# EAGLE design eagle8 (EAGLE 7.2.0)
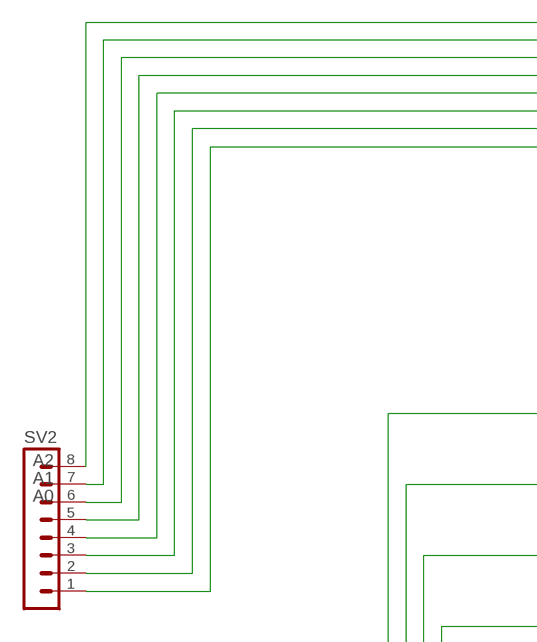
[diagram p0: schematic, sheet 1, part 1 of 3]
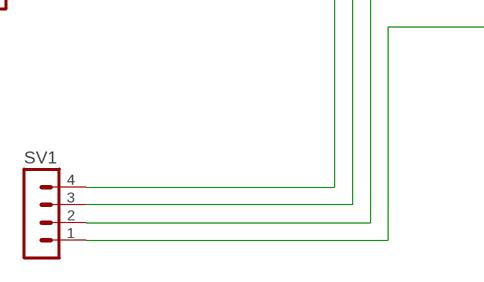
[diagram p1: schematic, sheet 1, part 2 of 3]
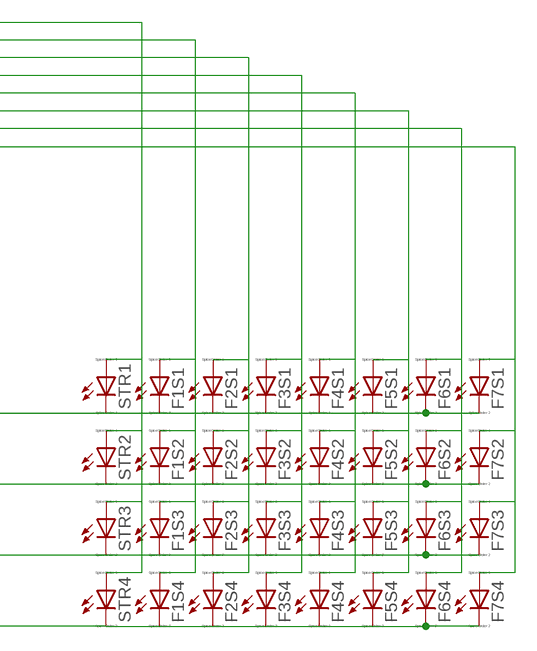
[diagram p2: schematic, sheet 1, part 3 of 3]

## Parts
F1S1  LED_ESML0603  [LED_SML0603]
F1S2  LED_ESML0603  [LED_SML0603]
F1S3  LED_ESML0603  [LED_SML0603]
F1S4  LED_ESML0603  [LED_SML0603]
F2S1  LED_ESML0603  [LED_SML0603]
F2S2  LED_ESML0603  [LED_SML0603]
F2S3  LED_ESML0603  [LED_SML0603]
F2S4  LED_ESML0603  [LED_SML0603]
F3S1  LED_ESML0603  [LED_SML0603]
F3S2  LED_ESML0603  [LED_SML0603]
F3S3  LED_ESML0603  [LED_SML0603]
F3S4  LED_ESML0603  [LED_SML0603]
F4S1  LED_ESML0603  [LED_SML0603]
F4S2  LED_ESML0603  [LED_SML0603]
F4S3  LED_ESML0603  [LED_SML0603]
F4S4  LED_ESML0603  [LED_SML0603]
F5S1  LED_ESML0603  [LED_SML0603]
F5S2  LED_ESML0603  [LED_SML0603]
F5S3  LED_ESML0603  [LED_SML0603]
F5S4  LED_ESML0603  [LED_SML0603]
F6S1  LED_ESML0603  [LED_SML0603]
F6S2  LED_ESML0603  [LED_SML0603]
F6S3  LED_ESML0603  [LED_SML0603]
F6S4  LED_ESML0603  [LED_SML0603]
F7S1  LED_ESML0603  [LED_SML0603]
F7S2  LED_ESML0603  [LED_SML0603]
F7S3  LED_ESML0603  [LED_SML0603]
F7S4  LED_ESML0603  [LED_SML0603]
STR1  LED_ESML0603  [LED_SML0603]
STR2  LED_ESML0603  [LED_SML0603]
STR3  LED_ESML0603  [LED_SML0603]
STR4  LED_ESML0603  [LED_SML0603]
SV1  MA04-1  [MA04-1]
SV2  MA08-1  [MA08-1]

## Nets
A0: F2S1.A F2S2.A F2S3.A F2S4.A SV2.6
A1: F1S1.A F1S2.A F1S3.A F1S4.A SV2.7
A2: STR1.A STR2.A STR3.A STR4.A SV2.8
N$2: F1S3.C F2S3.C F3S3.C F4S3.C F5S3.C F6S3.C F7S3.C STR3.C SV1.2
N$3: F1S2.C F2S2.C F3S2.C F4S2.C F5S2.C F6S2.C F7S2.C STR2.C SV1.3
N$8: F1S1.C F2S1.C F3S1.C F4S1.C F5S1.C F6S1.C F7S1.C STR1.C SV1.4
N$10: F7S1.A F7S2.A F7S3.A F7S4.A SV2.1
N$23: F6S1.A F6S2.A F6S3.A F6S4.A SV2.2
N$25: F4S1.A F4S2.A F4S3.A F4S4.A SV2.4
N$26: F3S1.A F3S2.A F3S3.A F3S4.A SV2.5
N$28: F1S4.C F2S4.C F3S4.C F4S4.C F5S4.C F6S4.C F7S4.C STR4.C SV1.1
N$35: F5S1.A F5S2.A F5S3.A F5S4.A SV2.3

## Library data of the parts
F1S1-F1S4 F2S1-F2S4 F3S1-F3S4 F4S1-F4S4 F5S1-F5S4 F6S1-F6S4 F7S1-F7S4 STR1-STR4 = eagle-ltspice:LED_E: LED Source: http://www.osram.convergy.de Source: www.luxeon.com Source: www.kingbright.com; SPICEMODEL: NONE; SPICEPREFIX: D; SPICETYPE: diode
SV1 = con-lstb:MA04-1: PIN HEADER; OC_FARNELL: unknown; OC_NEWARK: unknown
SV2 = con-lstb:MA08-1: PIN HEADER; OC_FARNELL: unknown; OC_NEWARK: unknown

## Board
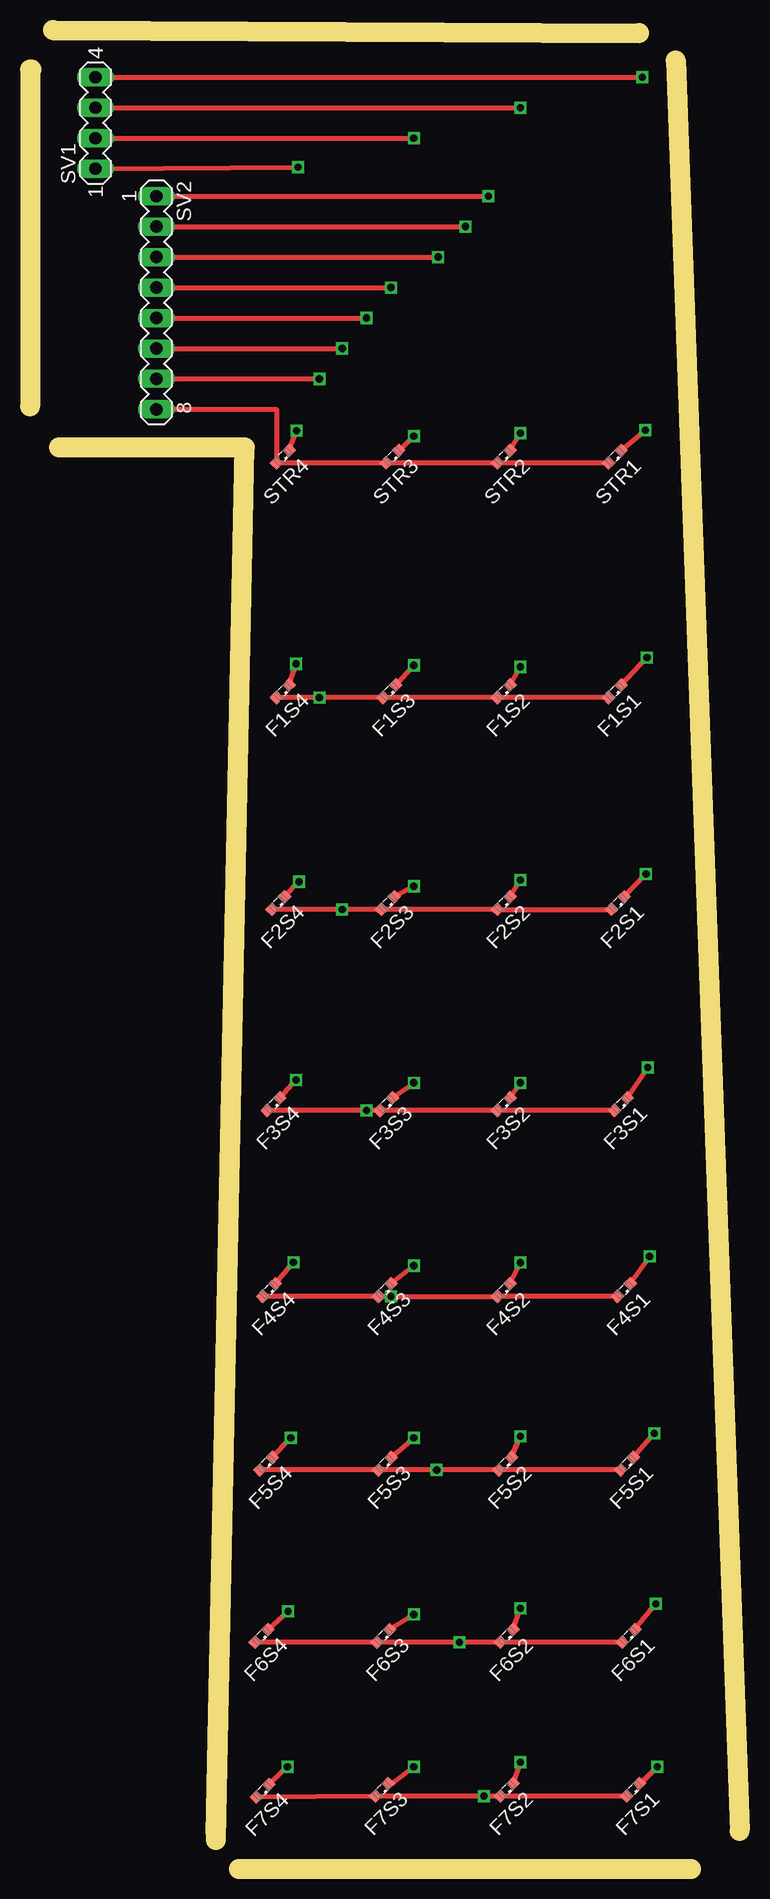
[diagram p3: board, top side]
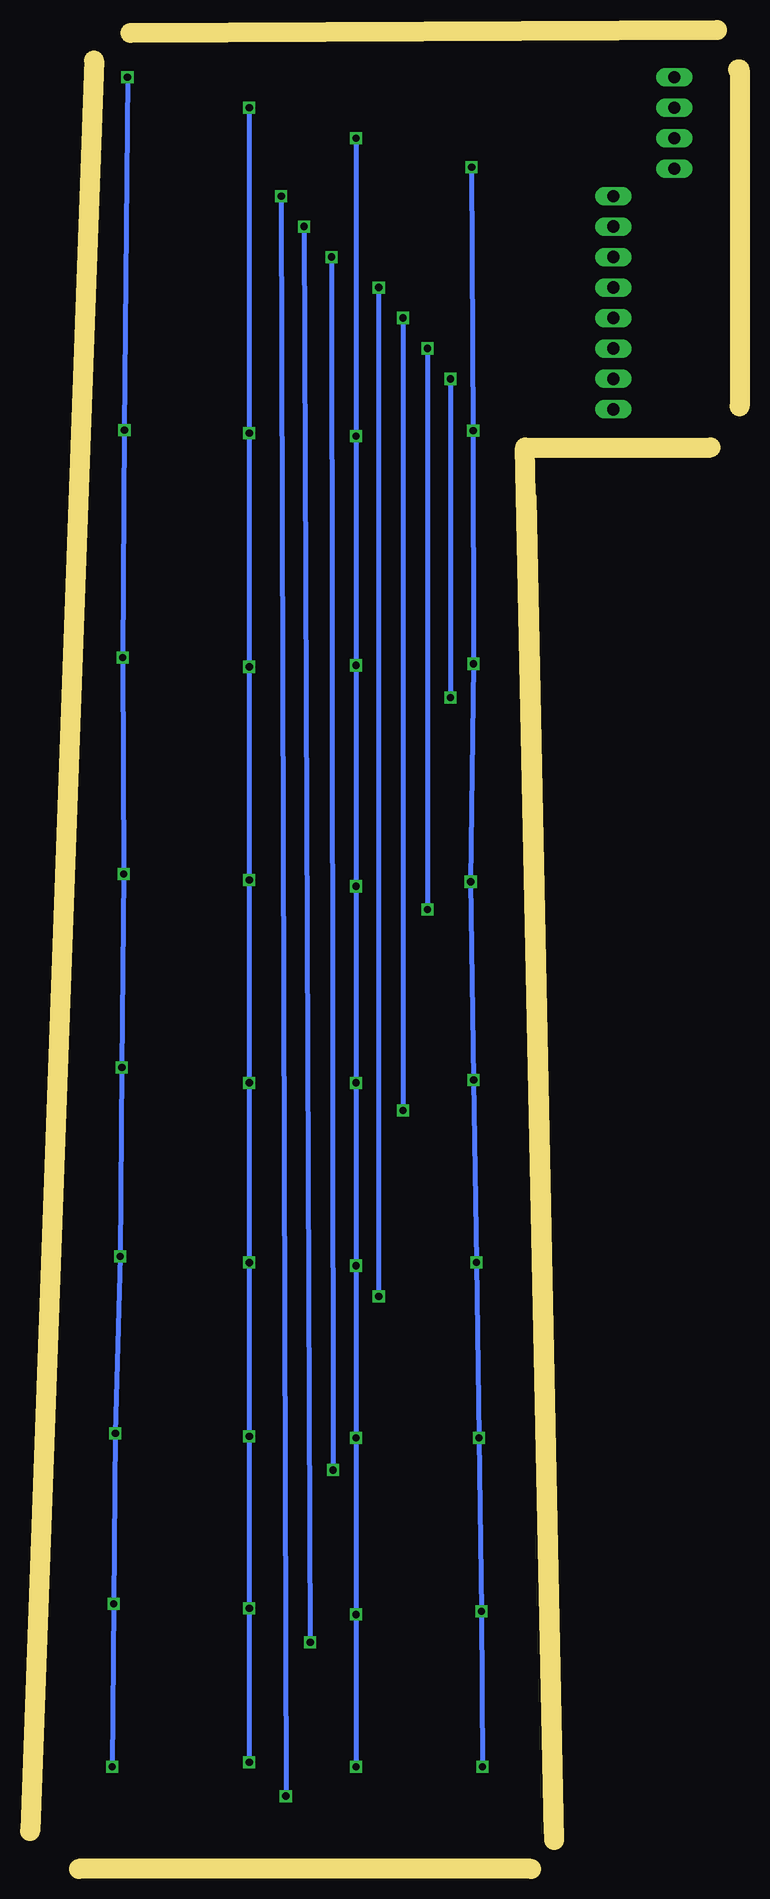
[diagram p4: board, bottom side, seen from below]

Size 59.18 x 153.29 mm. Coordinates in mm from the lower left corner, seen from the top.
Outline: 1.9,153.29 50.8,153.03
Outline: 53.85,150.75 59.18,3.17
Outline: 15.49,2.92 17.91,118.49 2.41,118.49
Outline: 0.13,149.99 0,149.99 0,121.92
Outline: 17.78,114.3 15.49,2.41
Outline: 17.4,0 55.12,0
Copper layers (1*16): Top 0.035mm / dielectric 1.5mm / Bottom 0.035mm
Design rules "default": minimum track width 10mil, minimum drill 24mil, track to track 8mil, track to pad 8mil, pad to pad 8mil, via to via 8mil, smd to smd 8mil, copper to edge 40mil, drill to drill 8mil, minimum pad ring 10mil, minimum via ring 8mil, stop-mask expansion 4mil, vias tented up to drill 0mil, thermal gap 10mil

### Footprints (pad centres in the part's own frame; a part is rotated, then mirrored left to right if it is on the bottom)
LED_SML0603 = smd 0.8 x 0.8: A 0.75,0; C -0.75,0
MA04-1 = drill 1.016 long: 1 -3.81,0; 2 -1.27,0; 3 1.27,0; 4 3.81,0
MA08-1 = drill 1.016 long: 1 -8.89,0; 2 -6.35,0; 3 -3.81,0; 4 -1.27,0; 5 1.27,0; 6 3.81,0; 7 6.35,0; 8 8.89,0

### Placement (x,y rotation side)
F1S1  48.77,98.17 225 top
F1S2  39.5,98.17 225 top
F1S3  29.97,98.17 225 top
F1S4  21.08,98.17 225 top
F2S1  49.02,80.52 225 top
F2S2  39.5,80.52 225 top
F2S3  29.85,80.52 225 top
F2S4  20.7,80.52 225 top
F3S1  49.28,63.75 225 top
F3S2  39.5,63.75 225 top
F3S3  29.72,63.75 225 top
F3S4  20.32,63.75 225 top
F4S1  49.53,48.26 225 top
F4S2  39.5,48.26 225 top
F4S3  29.59,48.26 225 top
F4S4  19.94,48.26 225 top
F5S1  49.78,33.78 225 top
F5S2  39.62,33.78 225 top
F5S3  29.59,33.78 225 top
F5S4  19.68,33.78 225 top
F6S1  49.91,19.43 225 top
F6S2  39.75,19.43 225 top
F6S3  29.46,19.43 225 top
F6S4  19.3,19.43 225 top
F7S1  50.29,6.6 225 top
F7S2  39.75,6.6 225 top
F7S3  29.34,6.6 225 top
F7S4  19.39,6.51 225 top
STR1  48.77,117.73 225 top
STR2  39.5,117.73 225 top
STR3  30.23,117.73 225 top
STR4  21.08,117.73 225 top
SV1  5.46,145.54 90 top
SV2  10.54,130.56 270 top

### Tracks (layer width: path | path; a pad name or v marks a point on that pad's centre or on a via)
A0  (via drill 0.6)
  Top 0.406: F2S1.A F2S2.A F2S3.A v26.04,79.99 F2S4.A | SV2.6 v26.04,126.75
  Bottom 0.406: v26.04,126.75 v26.04,79.99
A1  (via drill 0.6)
  Top 0.406: F1S1.A F1S2.A F1S3.A v24.13,97.64 F1S4.A | SV2.7 v24.13,124.21
  Bottom 0.406: v24.13,124.21 v24.13,97.64
A2
  Top 0.406: STR1.A STR2.A STR3.A STR4.A 20.55,121.67 SV2.8
N$2  (via drill 0.6)
  Top 0.406: STR3.C v32,119.42 | v32,8.51 30.25,7.13 F7S3.C | F6S3.C v32,21.21 | F5S3.C v32,35.94 | F4S3.C v32,50.29 | F3S3.C v32,65.53 | F2S3.C v32,81.92 | F1S3.C v32,100.33 | SV1.2 v32,144.27
  Bottom 0.406: v32,8.51 v32,21.21 v32,35.94 v32,50.29 v32,65.53 v32,81.92 v32,100.33 v32,119.42 v32,144.27
N$3  (via drill 0.6)
  Top 0.406: STR2.C v40.89,119.68 | v40.89,8.89 F7S2.C | F6S2.C v40.89,21.72 | F5S2.C v40.89,36.07 | F4S2.C v40.89,50.55 | F3S2.C v40.89,65.53 | F2S2.C v40.89,82.42 | F1S2.C v40.89,100.2 | SV1.3 v40.89,146.81
  Bottom 0.406: v40.89,8.89 v40.89,21.72 v40.89,36.07 v40.89,50.55 v40.89,65.53 v40.89,82.42 v40.89,100.2 v40.89,119.68 v40.89,146.81
N$8  (via drill 0.6)
  Top 0.406: STR1.C v51.31,119.93 | v52.32,8.51 50.95,7.13 F7S1.C | F6S1.C v52.2,22.1 | F5S1.C v52.06,36.32 | F4S1.C v51.67,51.05 | F3S1.C v51.52,66.81 | F2S1.C v51.37,82.93 | F1S1.C v51.45,100.97 | SV1.4 v51.05,149.35
  Bottom 0.406: v52.32,8.51 v52.2,22.1 v52.06,36.32 v51.67,51.05 v51.52,66.81 v51.37,82.93 v51.45,100.97 v51.31,119.93 v51.05,149.35
N$10  (via drill 0.6)
  Top 0.406: F7S1.A F7S2.A v37.85,6.07 F7S3.A F7S4.A | SV2.1 v38.23,139.45
  Bottom 0.406: v38.23,139.45 v37.85,6.07
N$23  (via drill 0.6)
  Top 0.406: F6S1.A F6S2.A v35.81,18.9 F6S3.A F6S4.A | SV2.2 v36.32,136.91
  Bottom 0.406: v36.32,136.91 v35.81,18.9
N$25  (via drill 0.6)
  Top 0.406: F4S1.A F4S2.A v30.1,47.73 F4S3.A F4S4.A | SV2.4 v30.1,131.83
  Bottom 0.406: v30.1,131.83 v30.1,47.73
N$26  (via drill 0.6)
  Top 0.406: F3S1.A F3S2.A F3S3.A v28.07,63.22 F3S4.A | SV2.5 v28.07,129.29
  Bottom 0.406: v28.07,129.29 v28.07,63.22
N$28  (via drill 0.6)
  Top 0.406: STR4.C v22.22,119.89 | v21.46,8.51 F7S4.C | F6S4.C v21.53,21.47 | F5S4.C v21.75,35.94 | F4S4.C v21.96,50.55 | F3S4.C v22.19,65.78 | F2S4.C v22.43,82.29 | F1S4.C v22.19,100.46 | SV1.1 v22.35,141.86
  Bottom 0.406: v21.46,8.51 v21.53,21.47 v21.75,35.94 v21.96,50.55 v22.19,65.78 v22.43,82.29 v22.19,100.46 v22.22,119.89 v22.35,141.86
N$35  (via drill 0.6)
  Top 0.406: F5S1.A F5S2.A v33.91,33.25 F5S3.A F5S4.A | SV2.3 v34.04,134.37
  Bottom 0.406: v34.04,134.37 v33.91,33.25
(copper drawn outside any net)
  shapes: Top area x2